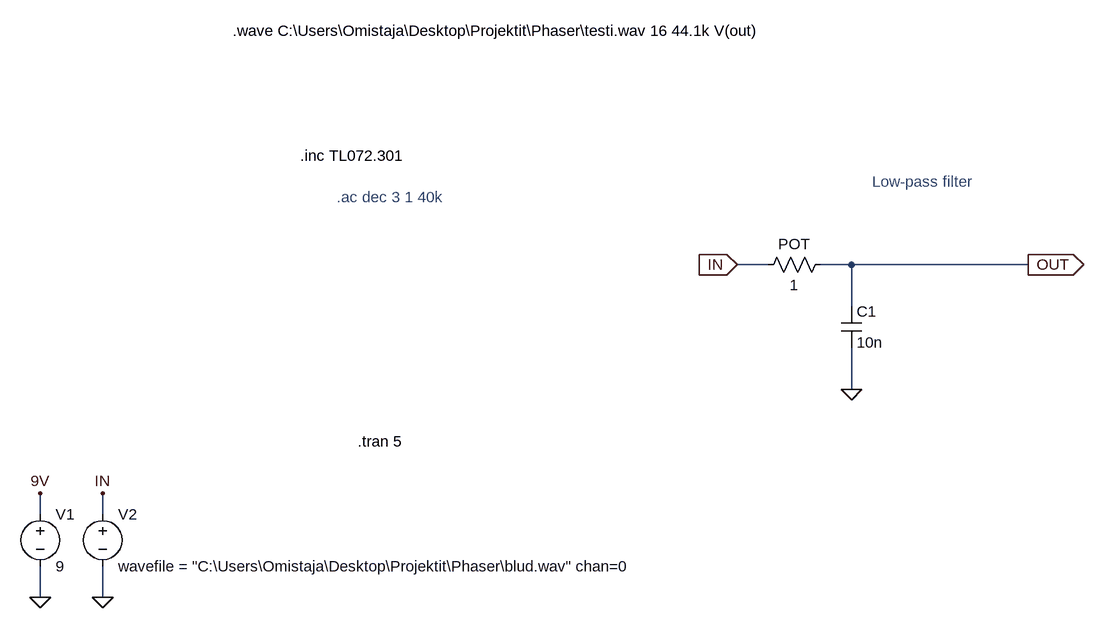
[diagram p0: schematic Low-pass filter.asc]
Low-pass filter.asc, the LTspice schematic file:
Version 4
SHEET 1 2188 820
WIRE 528 288 480 288
WIRE 656 288 608 288
WIRE 928 288 656 288
WIRE 656 352 656 288
WIRE 656 480 656 416
WIRE -592 672 -592 640
WIRE -496 672 -496 640
WIRE -592 800 -592 752
WIRE -496 800 -496 752
FLAG -592 800 0
FLAG -592 640 9V
FLAG 480 288 IN
IOPIN 480 288 In
FLAG 928 288 OUT
IOPIN 928 288 Out
FLAG -496 640 IN
FLAG -496 800 0
FLAG 656 480 0
SYMBOL voltage -592 656 R0
WINDOW 123 0 0 Left 0
WINDOW 39 0 0 Left 0
SYMATTR InstName V1
SYMATTR Value 9
SYMBOL res 624 272 R90
WINDOW 0 0 56 VBottom 2
WINDOW 3 32 56 VTop 2
SYMATTR InstName POT
SYMATTR Value 1
SYMBOL voltage -496 656 R0
SYMATTR InstName V2
SYMATTR Value wavefile = "C:\Users\Omistaja\Desktop\Projektit\Phaser\blud.wav" chan=0
SYMBOL cap 640 352 R0
SYMATTR InstName C1
SYMATTR Value 10n
TEXT -192 120 Left 2 !.inc TL072.301
TEXT -136 184 Left 2 ;.ac dec 3 1 40k
TEXT -104 560 Left 2 !.tran 5
TEXT 688 160 Left 2 ;Low-pass filter
TEXT -296 -72 Left 2 !.wave C:\\Users\\Omistaja\\Desktop\\Projektit\\Phaser\\testi.wav 16 44.1k V(out)

The netlist it stands for:
* Low-pass filter.asc
V1 9V 0 9
R§POT OUT IN 1
V2 IN 0 wavefile = "C:\Users\Omistaja\Desktop\Projektit\Phaser\blud.wav" chan=0
C1 OUT 0 10n
.inc TL072.301
* .ac dec 3 1 40k
.tran 5
* Low-pass filter
.wave C:\Users\Omistaja\Desktop\Projektit\Phaser\testi.wav 16 44.1k V(out)
.backanno
.end